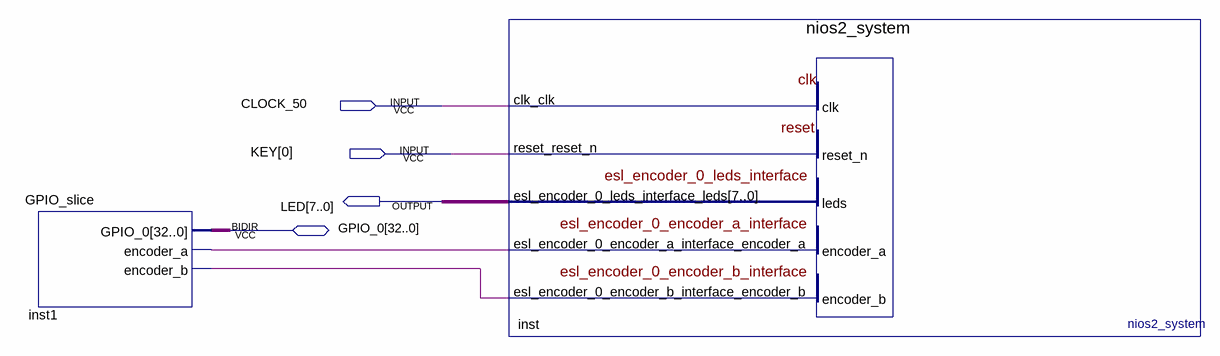
[diagram p0: schematic sheet]
// Quartus schematic nios2_quartus2_project.bdf as structural Verilog: 2 symbols, 4 pins
module nios2_quartus2_project (
  input  CLOCK_50,
  input  [0:0] KEY,
  inout  [32:0] GPIO_0,
  output [7:0] LED
);

  wire inst1_encoder_a, inst1_encoder_b;

  GPIO_slice inst1 (.encoder_a(inst1_encoder_a), .encoder_b(inst1_encoder_b), .GPIO_0(GPIO_0));
  nios2_system inst (
    .clk_clk(CLOCK_50), .reset_reset_n(KEY[0]),
    .esl_encoder_0_encoder_a_interface_encoder_a(inst1_encoder_a),
    .esl_encoder_0_encoder_b_interface_encoder_b(inst1_encoder_b), .esl_encoder_0_leds_interface_leds(LED));
endmodule
